# EAGLE design ESP-shild-1.0 (EAGLE 7.7.0)
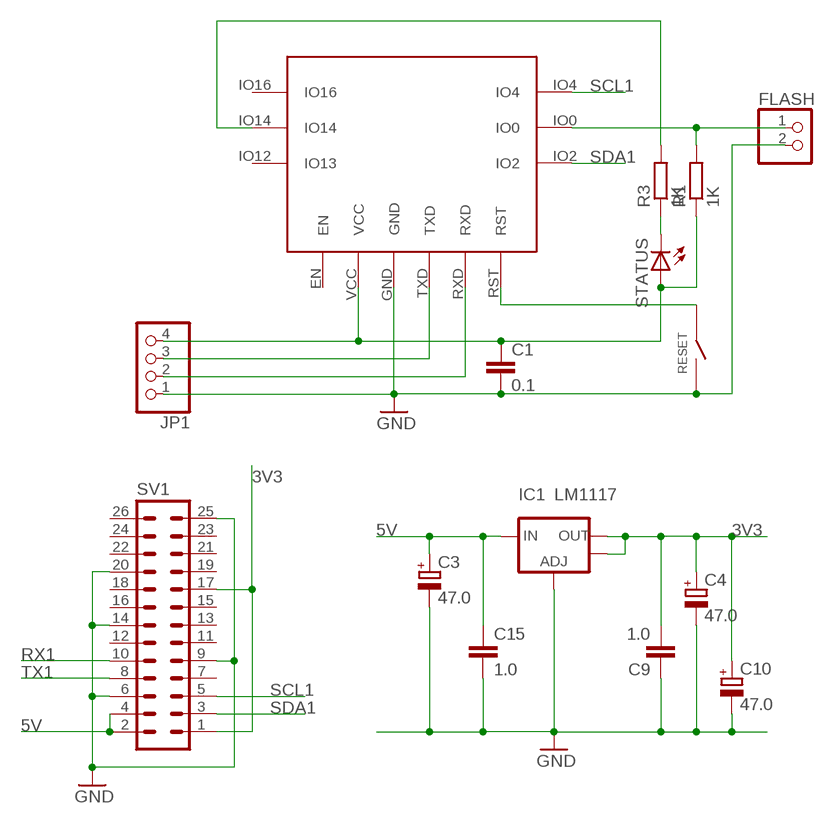
[diagram p0: schematic, sheet 1]

## Parts
C1  0.1  C-EUC0805  [C0805]
C3  47.0  CPOL-EUSMCD  [SMC_D]
C4  47.0  CPOL-EUSMCB  [SMC_B]
C9  1.0  C-EUC0805  [C0805]
C10  47.0  CPOL-EUSMCD  [SMC_D]
C15  1.0  C-EUC0805  [C0805]
ESP-M3  ESP-M3  [ESP-M3]
FLASH  PINHD-1X2/90  [1X02/90]
IC1  LM1117  V_REG_LM1117SOT223  [SOT223]
JP1  PINHD-1X4/90  [1X04/90]
R1  1K  R-EU_R0603  [R0603]
R3  1K  R-EU_R0603  [R0603]
RESET  TACT3X4  [TACT3X4]
STATUS  LEDSML1206  [SML1206]
SV1  MA13-2  [MA13-2]

## Nets
3V3: C1.1 C4.+ C9.2 C10.+ ESP-M3.VCC IC1.2(OUT) IC1.4(OUT) JP1.4 R1.1 STATUS.A SV1.1 SV1.17
5V: C3.+ C15.1 IC1.3(IN) SV1.2 SV1.4
FLASH: ESP-M3.IO0 FLASH.1 R1.2
GND: C1.2 C3.- C4.- C9.1 C10.- C15.2 ESP-M3.GND FLASH.2 IC1.1(ADJ) JP1.1 RESET.P$2 SV1.6 SV1.9 SV1.14 SV1.20 SV1.25
LED: ESP-M3.IO14 R3.2
N$6: R3.1 STATUS.C
RST: ESP-M3.RST RESET.P$1
RX1: ESP-M3.RXD JP1.2 SV1.10
SCL1: ESP-M3.IO4 SV1.5
SDA1: ESP-M3.IO2 SV1.3
TX1: ESP-M3.TXD JP1.3 SV1.8
Unconnected: ESP-M3.EN ESP-M3.IO12(IO13) ESP-M3.IO16 SV1.7 SV1.11 SV1.12 SV1.13 SV1.15 SV1.16 SV1.18 SV1.19 SV1.21 SV1.22 SV1.23 SV1.24 SV1.26

## Library data of the parts
C1 C9 C15 = rcl:C-EU: CAPACITOR, European symbol
C3 C4 C10 = rcl:CPOL-EU: POLARIZED CAPACITOR, European symbol
ESP-M3 = esp8266modules:ESP-M3: ESP8285 Model M3
FLASH = pinhead:PINHD-1X2: PIN HEADER
IC1 = SparkFun:V_REG_LM1117: Voltage Regulator LM1117 Standard adjustable voltage regulator but in SMD form. Spark Fun Electronics SKU : COM-00595
JP1 = pinhead:PINHD-1X4: PIN HEADER
R1 R3 = rcl:R-EU_: RESISTOR, European symbol
RESET = custom:TACT3X4
STATUS = led:LED: LED OSRAM: - CHIPLED LG R971, LG N971, LY N971, LG Q971, LY Q971, LO R971, LY R971 LH N974, LH R974 LS Q976, LO Q976, LY Q976 LO Q996 - Hyper CHIPLED LW Q18S LB Q993, LB Q99A, LB R99A - SideLED LS A670, LO A670, LY A670, LG A670, LP A670 LB A673, LV A673, LT A673, LW A673 LH A674 LY A675 LS A676, LA A676, LO A676, LY A676, LW A676 LS A679, LY A679, LG A679 - Hyper Micro SIDELED® LS Y876, LA Y876, LO Y876, LY Y876 LT Y87S - SmartLED LW L88C, LW L88S LB L89C, LB L89S, LG L890 LS L89K, LO L89K, LY L89K LS L896, LA L896, LO L896, LY L896 - TOPLED LS T670, LO T670, LY T670, LG T670, LP T670 LSG T670, LSP T670, LSY T670, LOP T670, LYG T670 LG T671, LOG T671, LSG T671 LB T673, LV T673, LT T673, LW T673 LH T674 LS T676, LA T676, LO T676, LY T676, LB T676, LH T676, LSB T676, LW T676 LB T67C, LV T67C, LT T67C, LS T67K, LO T67K, LY T67K, LW E67C LS E67B, LA E67B, LO E67B, LY E67B, LB E67C, LV E67C, LT E67C LW T67C LS T679, LY T679, LG T679 LS T770, LO T770, LY T770, LG T770, LP T770 LB T773, LV T773, LT T773, LW T773 LH T774 LS E675, LA E675, LY E675, LS T675 LS T776, LA T776, LO T776, LY T776, LB T776 LHGB T686 LT T68C, LB T68C - Hyper Mini TOPLED® LB M676 - Mini TOPLED Santana® LG M470 LS M47K, LO M47K, LY M47K Source: http://www.osram.convergy.de LUXEON: - LUMILED® LXK2-PW12-R00, LXK2-PW12-S00, LXK2-PW14-U00, LXK2-PW14-V00 LXK2-PM12-R00, LXK2-PM12-S00, LXK2-PM14-U00 LXK2-PE12-Q00, LXK2-PE12-R00, LXK2-PE12-S00, LXK2-PE14-T00, LXK2-PE14-U00 LXK2-PB12-K00, LXK2-PB12-L00, LXK2-PB12-M00, LXK2-PB14-N00, LXK2-PB14-P00, LXK2-PB14-Q00 LXK2-PR12-L00, LXK2-PR12-M00, LXK2-PR14-Q00, LXK2-PR14-R00 LXK2-PD12-Q00, LXK2-PD12-R00, LXK2-PD12-S00 LXK2-PH12-R00, LXK2-PH12-S00 LXK2-PL12-P00, LXK2-PL12-Q00, LXK2-PL12-R00 Source: www.luxeon.com KINGBRIGHT: KA-3528ASYC Source: www.kingbright.com
SV1 = con-lstb:MA13-2: PIN HEADER; OC_FARNELL: unknown; OC_NEWARK: unknown

## Net classes
0 default: width 0.254 mm, clearance 0.254 mm
1 POWER: width 0.508 mm, clearance 0.254 mm

## Board
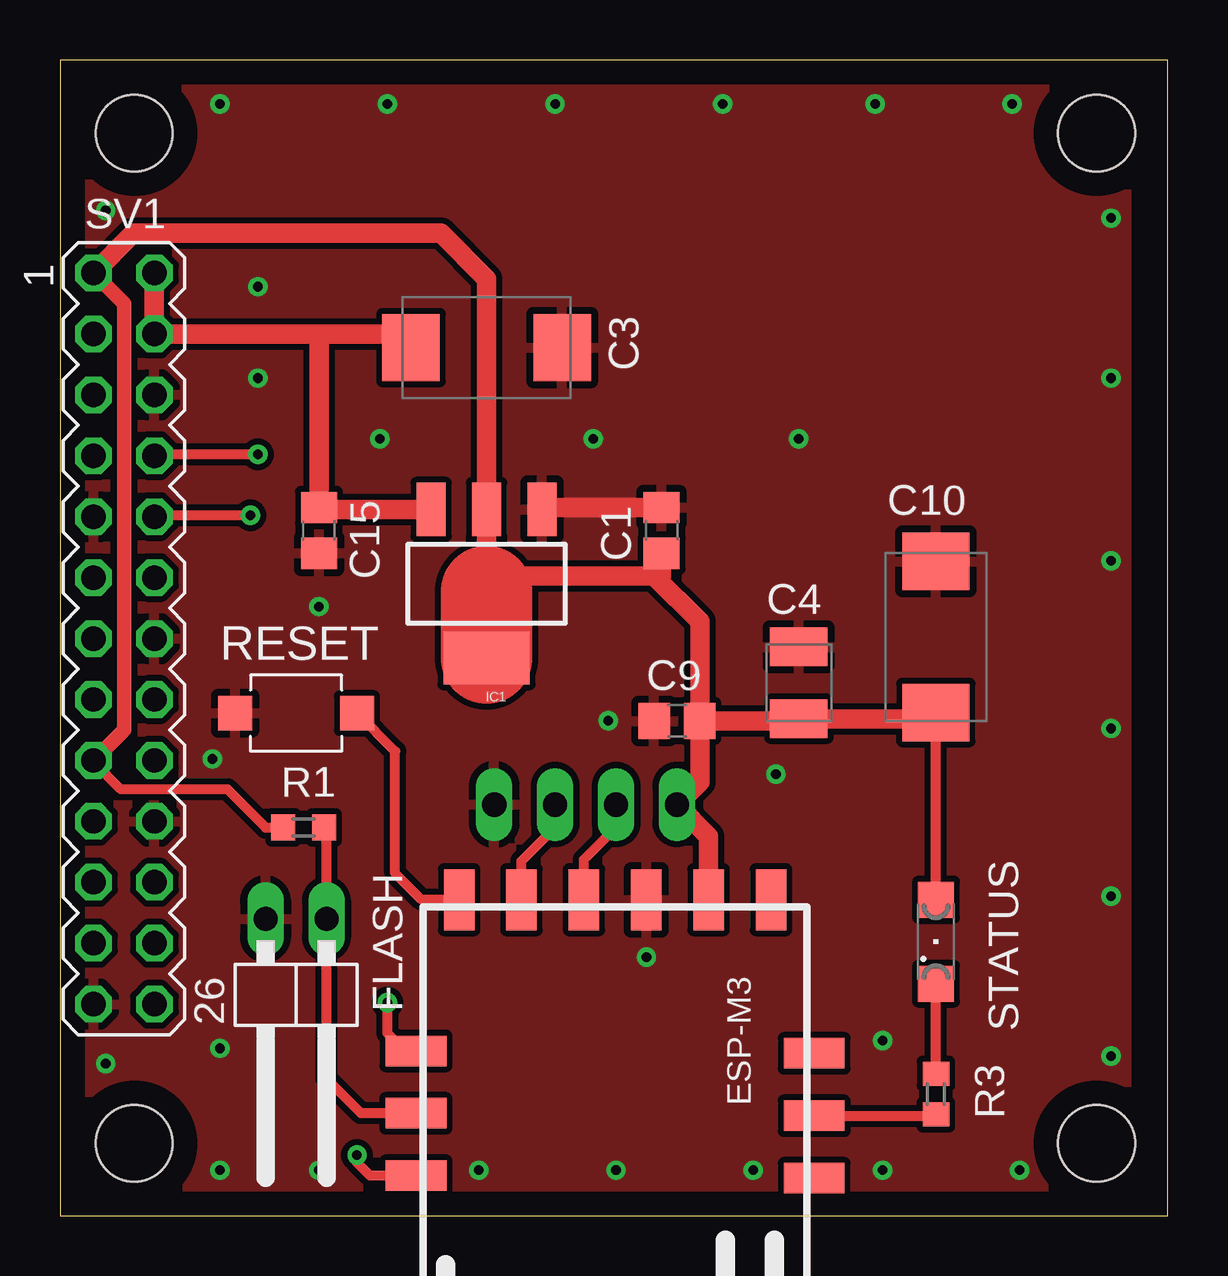
[diagram p1: board, top side]
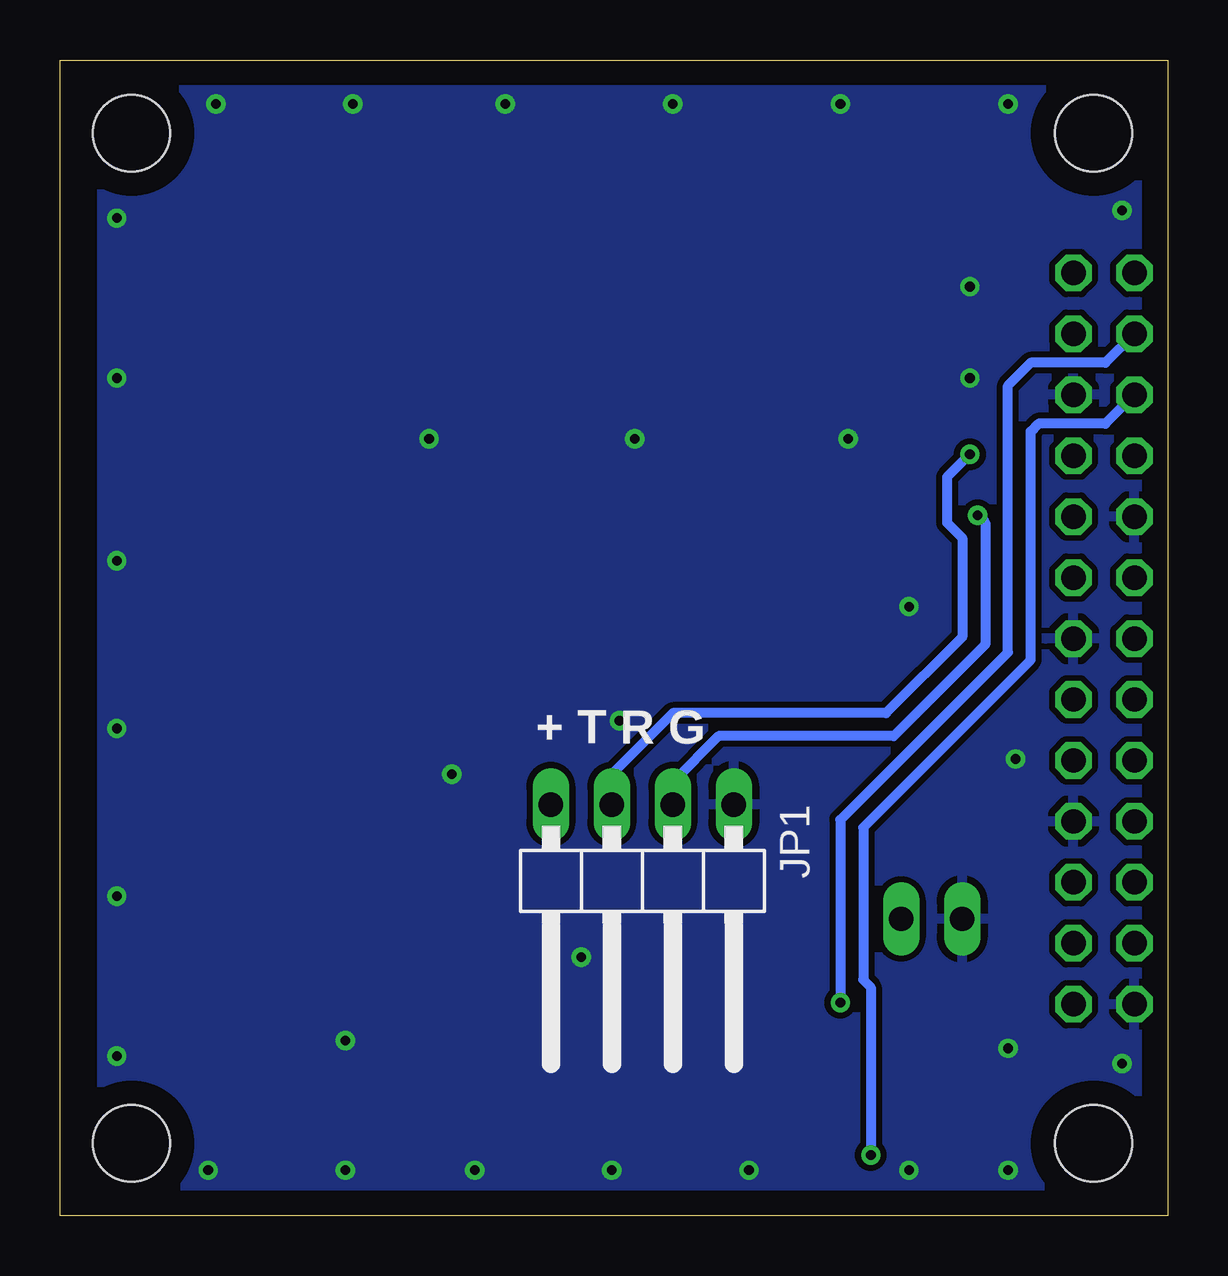
[diagram p2: board, bottom side, seen from below]

Size 46.18 x 48.18 mm. Coordinates in mm from the lower left corner, seen from the top.
Outline: 0,0 46.18,0 46.18,48.18 0,48.18 0,0
Copper layers (1*16): Top 0.035mm / dielectric 1.5mm / Bottom 0.035mm
Design rules "default *": minimum track width 10mil, minimum drill 24mil, track to track 8mil, track to pad 8mil, pad to pad 8mil, via to via 8mil, smd to smd 8mil, copper to edge 40mil, drill to drill 8mil, minimum pad ring 10mil, minimum via ring 8mil, stop-mask expansion 4mil, vias tented up to drill 20mil, thermal gap 12mil
Holes 3.2 mm at 3.1,45.14 43.21,45.14 43.21,3.02 3.1,3.02

### Footprints (pad centres in the part's own frame; a part is rotated, then mirrored left to right if it is on the bottom)
C0805 = smd 1.3 x 1.5: 1 -0.95,0; 2 0.95,0
SMC_D = smd 2.4 x 2.8: + -3.15,0; - 3.15,0
SMC_B = smd 1.6 x 2.4: + -1.5,0; - 1.5,0
ESP-M3 = smd 1.27 x 2.54: EN -6.46,-8.1; GND -1.26,-8.1; RST 6.54,-8.1; RXD 3.94,-8.1; TXD 1.34,-8.1; VCC -3.86,-8.1 | smd 2.54 x 1.27: IO0 8.34,0.8; IO2 8.34,-1.8; IO4 8.34,3.4; IO12 -8.26,-1.7; IO14 -8.26,0.9; IO16 -8.26,3.5
1X02/90 = drill 1.016 long: 1 -1.27,-3.81; 2 1.27,-3.81
SOT223 = smd 1.219 x 2.235: 1 -2.311,-3.099; 2 0,-3.099; 3 2.311,-3.099 | smd 3.6 x 2.2: 4 0,3.099
1X04/90 = drill 1.016 long: 1 -3.81,-3.81; 2 -1.27,-3.81; 3 1.27,-3.81; 4 3.81,-3.81
R0603 = smd 1 x 1.1: 1 -0.85,0; 2 0.85,0
TACT3X4 = smd 1.422 x 1.422: P$1 -0.635,1.587; P$2 4.445,1.587
SML1206 = smd 1.5 x 1.5: A 1.75,0; C -1.75,0
MA13-2 = drill 1.016 octagon: 1 -15.24,-1.27; 2 -15.24,1.27; 3 -12.7,-1.27; 4 -12.7,1.27; 5 -10.16,-1.27; 6 -10.16,1.27; 7 -7.62,-1.27; 8 -7.62,1.27; 9 -5.08,-1.27; 10 -5.08,1.27; 11 -2.54,-1.27; 12 -2.54,1.27; 13 0,-1.27; 14 0,1.27; 15 2.54,-1.27; 16 2.54,1.27; 17 5.08,-1.27; 18 5.08,1.27; 19 7.62,-1.27; 20 7.62,1.27; 21 10.16,-1.27; 22 10.16,1.27; 23 12.7,-1.27; 24 12.7,1.27; 25 15.24,-1.27; 26 15.24,1.27

### Placement (x,y rotation side)
C1  25.08,28.57 90 top
C3  17.78,36.2 0 top
C4  30.8,22.23 90 top
C9  25.72,20.64 0 top
C10  36.51,24.13 90 top
C15  10.79,28.57 270 top
ESP-M3  23.18,5.08 180 top
FLASH  9.84,8.57 180 top
IC1  17.78,26.35 180 top
JP1  21.91,13.34 180 bottom
R1  10.16,16.19 0 top
R3  36.51,5.08 270 top
RESET  11.75,22.54 180 top
STATUS  36.51,11.43 90 top
SV1  2.67,24.07 270 top

### Tracks (layer width: path | path; a pad name or v marks a point on that pad's centre or on a via)
3V3
  Top 0.406: STATUS.A C10.+ | R1.1 8.57,16.19 6.99,17.78 2.54,17.78 1.4,18.92 SV1.17
  Top 0.61: SV1.17 2.67,20.26 2.67,38.04 SV1.1
  Top 0.813: 17.78,26.04 17.78,26.67 | 17.78,26.67 IC1.2 17.78,39.05 15.88,40.96 3.05,40.96 SV1.1 | C1.1 25.08,26.67 24.77,26.67 | 24.77,26.67 17.78,26.67 | C9.2 26.67,24.77 24.77,26.67 | C9.2 30.71,20.64 C4.+ 36.26,20.73 C10.+ | ESP-M3.VCC 27.04,15.82 JP1.4 26.67,18.09 C9.2
  Top 3.81: IC1.4 17.78,26.04
5V
  Top 0.813: SV1.2 SV1.4 10.79,36.77 | 10.79,36.77 14.63,36.77 C3.+ | 10.79,36.77 C15.1 10.79,29.45 IC1.3
FLASH
  Top 0.406: R1.2 11.11,16.09 FLASH.1 11.11,5.71 12.55,4.28 ESP-M3.IO0
GND  (via drill 0.4)
  Top 0.813: IC1.1 20.16,29.52 C1.2
  other vias: 6.67,1.91 10.79,1.91 17.46,1.91 28.89,1.91 23.18,1.91 34.29,1.91 40.01,1.91 43.81,6.67 6.67,6.99 34.29,7.3 24.45,10.79 43.81,13.34 43.81,20.32 43.81,27.3 43.81,34.92 43.81,41.59 39.69,46.35 33.97,46.35 27.62,46.35 20.64,46.35 13.65,46.35 6.67,46.35 1.91,41.91 8.26,38.73 8.26,34.92 13.34,32.38 22.23,32.38 30.8,32.38 29.84,18.41 22.86,20.64 10.79,25.4 6.35,19.05 1.91,6.35
  pour Bottom: 5.08,46.99 44.45,46.99 44.45,30.48 44.45,1.27 1.27,1.27 1.27,15.24 1.27,46.99
  pour Top: 1.27,46.99 44.45,46.99 44.45,0.95 1.27,0.95 1.27,1.59
LED
  Top 0.406: ESP-M3.IO14 36.46,4.18 R3.2
N$6
  Top 0.406: R3.1 STATUS.C
RST
  Top 0.406: ESP-M3.RST 15.08,13.18 13.97,14.29 13.97,19.37 RESET.P$1
RX1  (via drill 0.4)
  Top 0.406: ESP-M3.RXD 19.24,14.79 20.64,16.19 JP1.2 | SV1.10 4,29.21 v7.94,29.21
  Bottom 0.406: v7.94,29.21 7.62,28.89 7.62,23.81 11.43,20 18.73,20 20.64,18.1 JP1.2
SCL1  (via drill 0.4)
  Top 0.406: ESP-M3.IO4 12.93,1.68 12.38,2.22 v12.38,2.54
  Bottom 0.406: SV1.5 2.6,33.02 5.4,33.02 5.71,32.7 5.71,23.18 12.7,16.19 12.7,9.84 12.38,9.53 v12.38,2.54
SDA1  (via drill 0.4)
  Top 0.406: ESP-M3.IO2 14.39,6.88 13.65,7.62 v13.65,8.89
  Bottom 0.406: SV1.3 2.6,35.56 5.71,35.56 6.67,34.61 6.67,23.5 13.65,16.51 v13.65,8.89
TX1  (via drill 0.4)
  Top 0.406: ESP-M3.TXD 21.84,14.85 23.18,16.19 JP1.3 | SV1.8 4,31.75 v8.26,31.75
  Bottom 0.406: v8.26,31.75 9.21,30.8 9.21,28.89 8.57,28.26 8.57,24.13 11.75,20.95 20.64,20.95 23.18,18.41 JP1.3

### Text on the board
tNames: RESET
bNames: + T R G